# EAGLE design coqui-v1.0-linear (EAGLE 7.1.0)
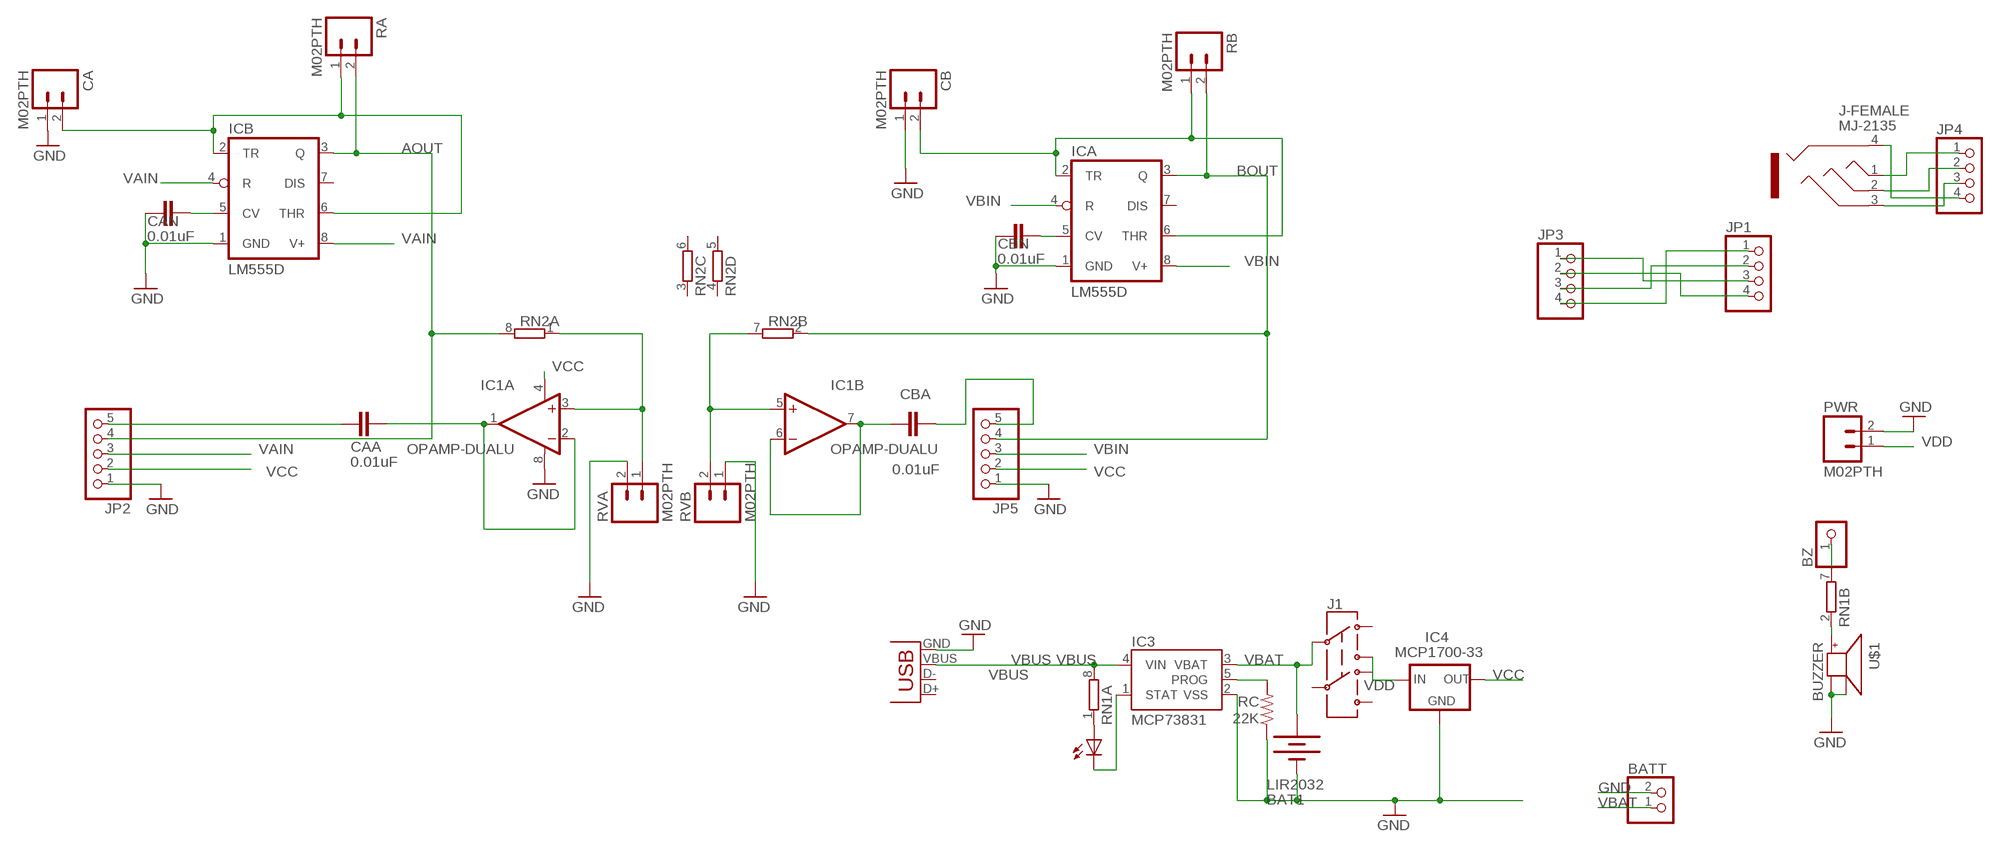
[diagram p0: schematic, sheet 1]

## Parts
BAT1  LIR2032  BATTERYBATTCOM_20MM_PTH_SMT  [BATTCOM_20MM_PTH_SMT]
BATT  JST_2PIN-SMT-RA  [JST-PH-2-SMT-RA]
BZ  PINHD-1X1  [1X01]
CA  M02PTH  [1X02]
CAA  0.01uF  C-EUC0805  [C0805@1]
CAN  0.01uF  C-EUC0805  [C0805@1]
CB  M02PTH  [1X02]
CBA  0.01uF  C-EUC0805  [C0805@1]
CBN  0.01uF  C-EUC0805  [C0805@1]
CHG  0805  LEDCHIPLED_0805  [CHIPLED_0805]
IC1  OPAMP-DUALU  [SO08]
IC3  MCP73831  [SOT23-5]
IC4  MCP1700-33  MCP1700SOT89  [SOT89]
ICA  LM555D  [SO08]
ICB  LM555D  [SO08]
J1  AYZ0202  [AYZ0202]
J-FEMALE  MJ-2135  [MJ-2135]
JP1  PINHD-1X4/90  [1X04/90]
JP2  PINHD-1X5  [1X05]
JP3  PINHD-1X4  [1X04]
JP4  PINHD-1X4  [1X04]
JP5  PINHD-1X5  [1X05]
PWR  M02PTH  [1X02]
RA  M02PTH  [1X02]
RB  M02PTH  [1X02]
RC  22K  R-US_R0805  [R0805]
RN1  4R-NEXB38V  [EXB38V]
RN2  4R-NEXB38V  [EXB38V]
RVA  M02PTH  [1X02]
RVB  M02PTH  [1X02]
U$1  BUZZER  [SMT-8585-BUZZER]
X1  USBSMD  [USB-MINIB]

## Nets
AOUT: ICB.3(Q) JP2.4 RA.2 RN2.8
BOUT: ICA.3(Q) JP5.4 RB.2 RN2.2
GND: BAT1.P$1(-) BATT.2 CA.1 CAN.1 CB.1 CBN.1 IC1.8(A:V+) IC3.2(VSS) IC4.1(GND) ICA.1(GND) ICB.1(GND) JP2.1 JP5.1 PWR.2 RC.1 RVA.2 RVB.1 U$1.- U$1.A- X1.GND
N$1: J-FEMALE.1 JP4.1
N$2: J-FEMALE.2 JP4.2
N$3: IC3.5(PROG) RC.2
N$4: J-FEMALE.3 JP4.3
N$5: CHG.C IC3.1(STAT)
N$6: J-FEMALE.4 JP4.4
N$7: BZ.1 RN1.7
N$8: CHG.A RN1.1
N$9: CAA.1 JP2.5
N$10: CAA.2 IC1.1(A:OUT) IC1.2(A:-IN)
N$11: CA.2 ICB.2(TR) ICB.6(THR) RA.1
N$12: RN1.2 U$1.+
N$13: CBA.2 JP5.5
N$14: CAN.2 ICB.5(CV)
N$15: CBN.2 ICA.5(CV)
N$16: CB.2 ICA.2(TR) ICA.6(THR) RB.1
N$18: JP1.1 JP3.4
N$19: JP1.3 JP3.1
N$20: JP1.2 JP3.3
N$21: JP1.4 JP3.2
N$23: IC1.3(A:+IN) IC1.5(B:+IN) RN2.1 RN2.7 RVA.1 RVB.2
N$24: CBA.1 IC1.6(B:-IN) IC1.7(B:OUT)
VAIN: ICB.4(R) ICB.8(V+) JP2.3
VBAT [power]: BAT1.P$2(+) BATT.1 IC3.3(VBAT) J1.2
VBIN: ICA.4(R) ICA.8(V+) JP5.3
VBUS [power]: IC3.4(VIN) RN1.8 X1.VBUS
VCC: IC1.4(A:V-) IC4.3(OUT) JP2.2 JP5.2
VDD: IC4.2(IN) J1.1 PWR.1
Unconnected: ICA.7(DIS) ICB.7(DIS) J1.3 J1.4 J1.5 J1.6 RN1.3 RN1.4 RN1.5 RN1.6 RN2.3 RN2.4 RN2.5 RN2.6 X1.D+ X1.D-

## Library data of the parts
BAT1 = SparkFunNew:BATTERY: Battery Holders Various common sizes : AA, AAA, 20mm coin cell and 12mm coin cell.
BATT = adafruit:JST_2PIN: JST 2-Pin Connectors of various flavors SMT-RA (S2B-PH-SM4) 4UConnector #17311 SMT (B2B-PH-SM4) THM-RA (S2B-PH) THM (B2B-PH)
BZ = pinhead:PINHD-1X1: PIN HEADER
CA CB PWR RA RB RVA RVB = SparkFun-Connectors:M02: Standard 2-pin 0.1" header. Use with - straight break away headers ( PRT-00116) - right angle break away headers (PRT-00553) - swiss pins (PRT-00743) - machine pins (PRT-00117) - female headers (PRT-00115) Molex polarized connector foot print use with: PRT-08233 with associated crimp pins and housings. 2.54_SCREWTERM for use with PRT-10571. 3.5mm Screw Terminal footprints for PRT-08084 5mm Screw Terminal footprints for use with PRT-08432
CAA CAN CBA CBN = rcl:C-EU: CAPACITOR, European symbol
CHG = led:LED: LED OSRAM: - CHIPLED LG R971, LG N971, LY N971, LG Q971, LY Q971, LO R971, LY R971 LH N974, LH R974 LS Q976, LO Q976, LY Q976 LO Q996 - Hyper CHIPLED LW Q18S LB Q993, LB Q99A, LB R99A - SideLED LS A670, LO A670, LY A670, LG A670, LP A670 LB A673, LV A673, LT A673, LW A673 LH A674 LY A675 LS A676, LA A676, LO A676, LY A676, LW A676 LS A679, LY A679, LG A679 - Hyper Micro SIDELED® LS Y876, LA Y876, LO Y876, LY Y876 LT Y87S - SmartLED LW L88C, LW L88S LB L89C, LB L89S, LG L890 LS L89K, LO L89K, LY L89K LS L896, LA L896, LO L896, LY L896 - TOPLED LS T670, LO T670, LY T670, LG T670, LP T670 LSG T670, LSP T670, LSY T670, LOP T670, LYG T670 LG T671, LOG T671, LSG T671 LB T673, LV T673, LT T673, LW T673 LH T674 LS T676, LA T676, LO T676, LY T676, LB T676, LH T676, LSB T676, LW T676 LB T67C, LV T67C, LT T67C, LS T67K, LO T67K, LY T67K, LW E67C LS E67B, LA E67B, LO E67B, LY E67B, LB E67C, LV E67C, LT E67C LW T67C LS T679, LY T679, LG T679 LS T770, LO T770, LY T770, LG T770, LP T770 LB T773, LV T773, LT T773, LW T773 LH T774 LS E675, LA E675, LY E675, LS T675 LS T776, LA T776, LO T776, LY T776, LB T776 LHGB T686 LT T68C, LB T68C - Hyper Mini TOPLED® LB M676 - Mini TOPLED Santana® LG M470 LS M47K, LO M47K, LY M47K Source: http://www.osram.convergy.de LUXEON: - LUMILED® LXK2-PW12-R00, LXK2-PW12-S00, LXK2-PW14-U00, LXK2-PW14-V00 LXK2-PM12-R00, LXK2-PM12-S00, LXK2-PM14-U00 LXK2-PE12-Q00, LXK2-PE12-R00, LXK2-PE12-S00, LXK2-PE14-T00, LXK2-PE14-U00 LXK2-PB12-K00, LXK2-PB12-L00, LXK2-PB12-M00, LXK2-PB14-N00, LXK2-PB14-P00, LXK2-PB14-Q00 LXK2-PR12-L00, LXK2-PR12-M00, LXK2-PR14-Q00, LXK2-PR14-R00 LXK2-PD12-Q00, LXK2-PD12-R00, LXK2-PD12-S00 LXK2-PH12-R00, LXK2-PH12-S00 LXK2-PL12-P00, LXK2-PL12-Q00, LXK2-PL12-R00 Source: www.luxeon.com KINGBRIGHT: KA-3528ASYC Source: www.kingbright.com
IC1 = SparkFun-AnalogIC:OPAMP-DUAL: Generic op-amp footprint
IC3 = SparkFunNew:MCP73831: Microchip's MCP73831 Miniature single cell, fully integrated Li-Ion, Li-polymer charge management controller http://ww1.microchip.com/downloads/en/DeviceDoc/21984a.pdf
IC4 = adafruit:MCP1700: VOLTAGE REGULATOR
ICA ICB = adafruit:*555: TIMER Changed DIP package to have round (not oval) pin pads http://www.ladyada.net/library/pcb/eaglelibrary.html
J1 = SparkFunNew:AYZ0202: SPDT Slide Switch Simple SMD single-pull double-throw slide switch. Good for less than 350mA power switch, switching UARTs between devices, etc. Spark Fun Electronics SKU : COM-00597
J-FEMALE = iPhoneSoftModem:MJ-2135
JP1 = trrs-dwb:PINHD-1X4: PIN HEADER
JP2 JP5 = pinhead:PINHD-1X5: PIN HEADER
JP3 JP4 = pinhead:PINHD-1X4: PIN HEADER
RC = adafruit2013:R-US_: RESISTOR, American symbol
RN1 RN2 = resistor-dil:4R-N: Array Chip Resistor Source: RS Component / Phycomp; OC_FARNELL: unknown; OC_NEWARK: unknown
U$1 = adafruit:BUZZER
X1 = SparkFun:USB: USB Connectors USB-B-PTH is fully proven SKU : PRT-00139 USB-miniB is fully proven SKU : PRT-00587 USB-A-PCB is untested. USB-A-H is throughly reviewed, but untested. Spark Fun Electronics SKU : PRT-00437 USB-B-SMT is throughly reviewed, but untested. Needs silkscreen touching up. USB-A-S has not been used/tested USB-MB-H has not been used/tested

## Net classes
0 default: width 0.254 mm, clearance 0.203 mm
1 power: width 0.254 mm, clearance 0.178 mm

## Board
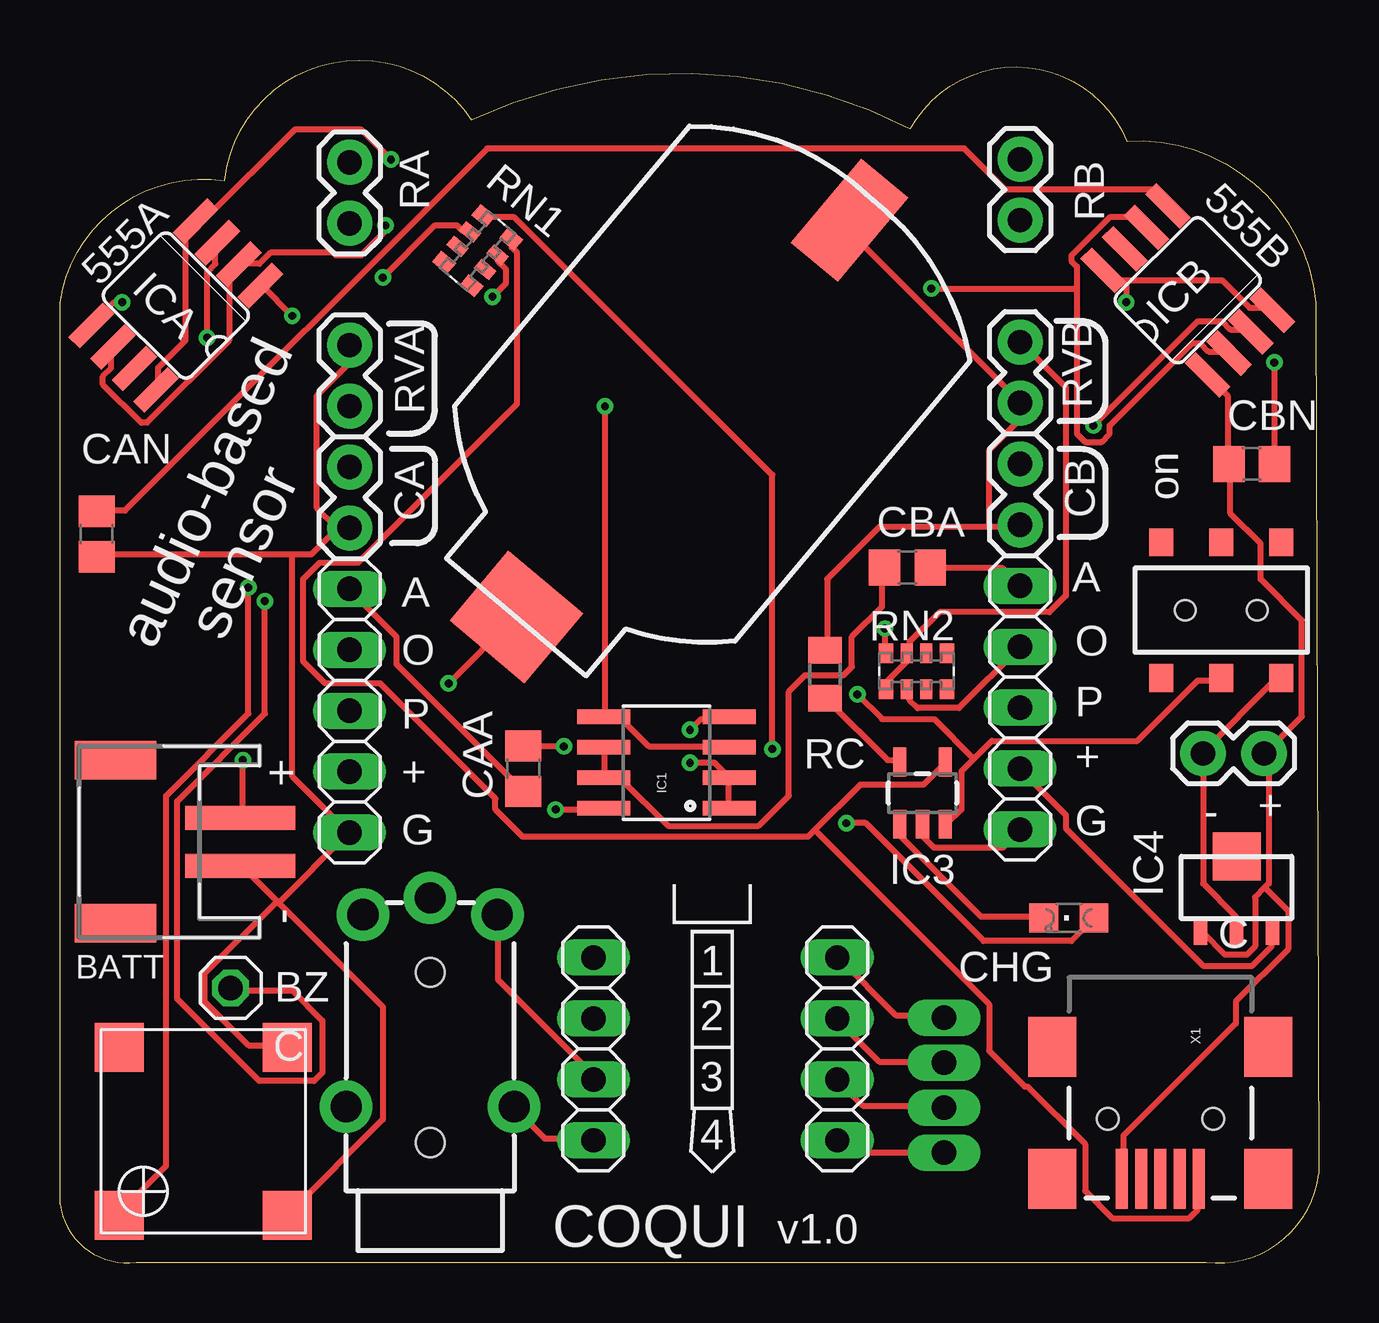
[diagram p1: board, top side]
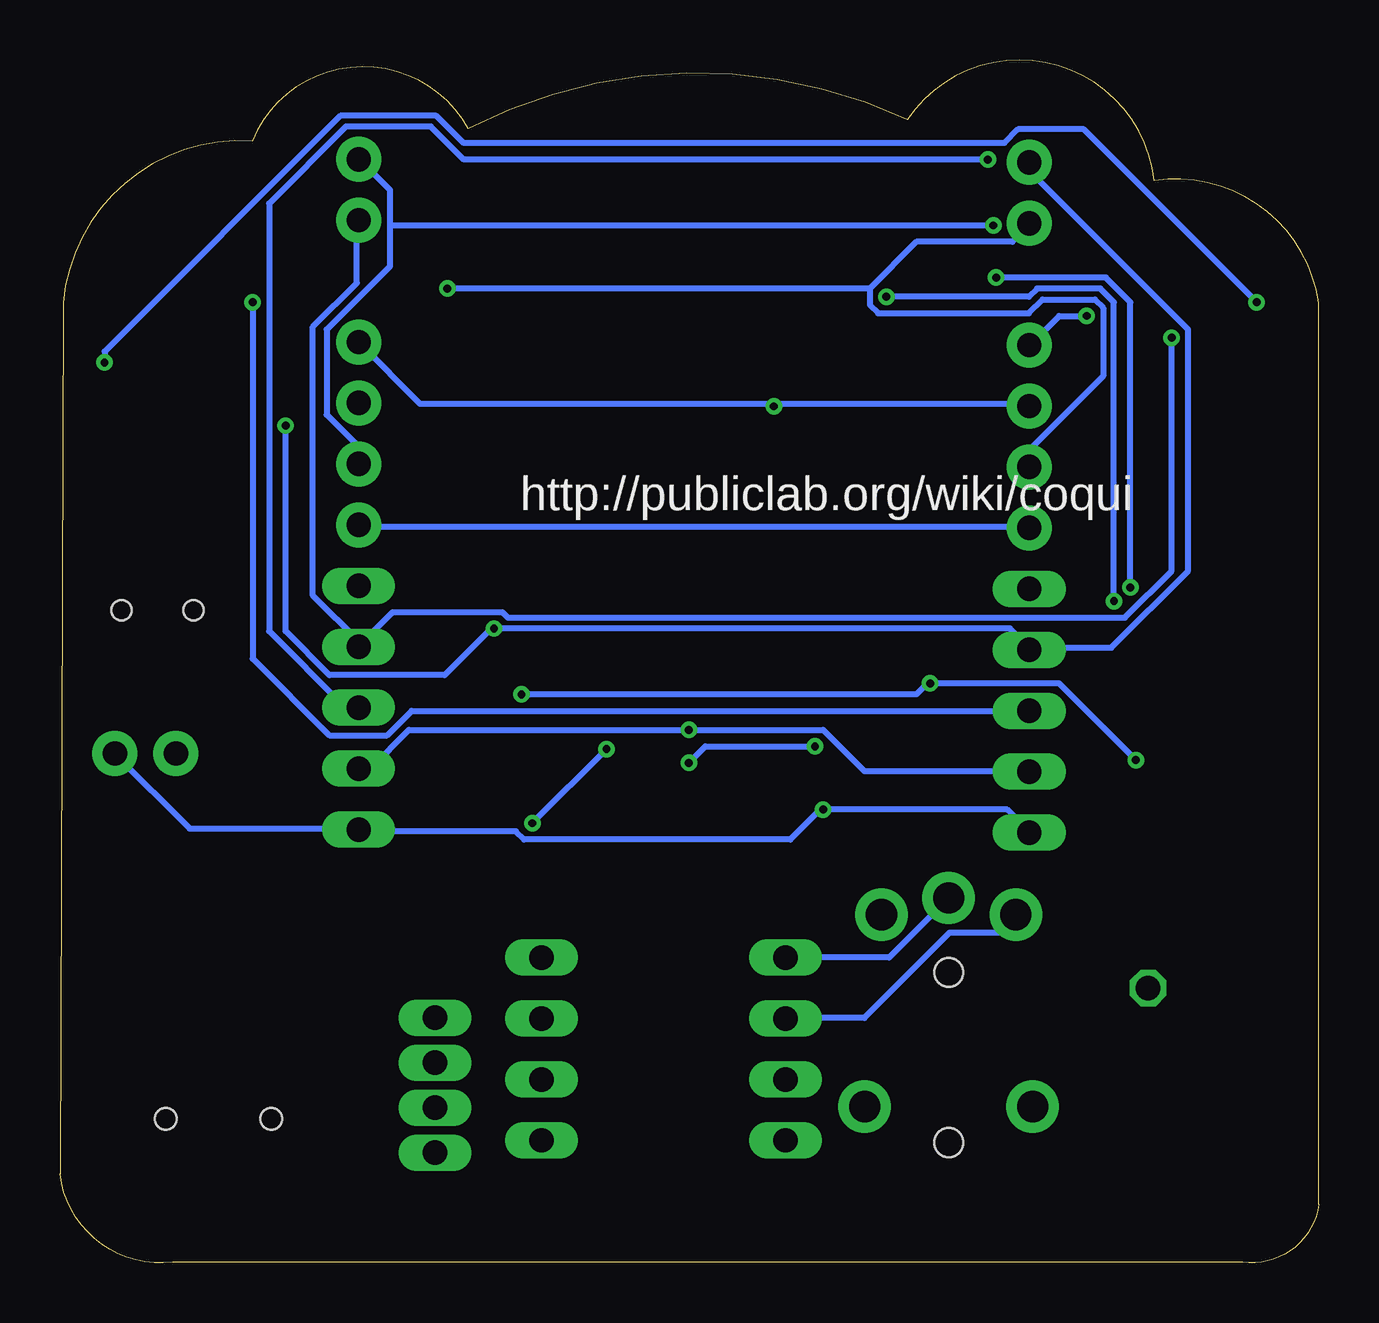
[diagram p2: board, bottom side, seen from below]

Size 52.45 x 50.14 mm. Coordinates in mm from the lower left corner, seen from the top.
Outline: 6.86,45.11 arc-140 17.14,47.65 arc-52 35.43,47.27 arc-128 44.45,46.76 arc-88 52.32,40.03 52.45,3.71 arc-90 47.75,0.03 3.17,0.03 arc-90 0,2.44 0,40.03 arc-90 6.86,45.11
Copper layers (1*16): Top 0.0356mm / dielectric 1.5011mm / Bottom 0.0356mm
Design rules "oshpark-2layer": minimum track width 6mil, minimum drill 13mil, track to track 6mil, track to pad 6mil, pad to pad 6mil, via to via 6mil, smd to smd 6mil, copper to edge 15mil, drill to drill 6mil, minimum pad ring 7mil, minimum via ring 7mil, stop-mask expansion 4mil, vias tented up to drill 0mil, thermal gap 10mil

### Footprints (pad centres in the part's own frame; a part is rotated, then mirrored left to right if it is on the bottom)
BATTCOM_20MM_PTH_SMT = smd 4.572 x 2.54: P$1 0,0 | smd 3.81 x 4.064: P$2 21.59,0
JST-PH-2-SMT-RA = smd 1 x 4.6: 1 1,-3.7; 2 -1,-3.7 | smd 1.6 x 3.4: NC1 -3.4,1.5; NC2 3.4,1.5
1X01 = drill 1.016 octagon: 1 0,0
1X02 = drill 1.016 pad 1.88: 1 0,0; 2 2.54,0
C0805@1 = smd 1.3 x 1.5: 1 -0.95,0; 2 0.95,0
CHIPLED_0805 = smd 1.2 x 1.2: A 0,-1.05; C 0,1.05
SO08 = smd 0.61 x 2.21: 1 -1.905,-2.616; 2 -0.635,-2.616; 3 0.635,-2.616; 4 1.905,-2.616; 5 1.905,2.616; 6 0.635,2.616; 7 -0.635,2.616; 8 -1.905,2.616
SOT23-5 = smd 0.55 x 1.2: 1 -0.95,-1.3; 2 0,-1.3; 3 0.95,-1.3; 4 0.95,1.3; 5 -0.95,1.3
SOT89 = smd 0.58 x 1.2: 1 -1.5,-1.8; 2 0,-1.8; 3 1.5,-1.8 | smd 2 x 2: 4 0,1.3
SO08' = smd 0.66 x 2.032: 1 -1.905,-3.073; 2 -0.635,-3.073; 3 0.635,-3.073; 4 1.905,-3.073; 5 1.905,3.073; 6 0.635,3.073; 7 -0.635,3.073; 8 -1.905,3.073
AYZ0202 = smd 1 x 1.15: 1 -2.5,2.825; 2 0,2.825; 3 2.5,2.825; 4 -2.5,-2.825; 5 0,-2.825; 6 2.5,-2.825 | hole 0.85: 1.5,0; -1.5,0
MJ-2135 = drill 1.3 pad 2.184: 1 0,8.5; 1@2 7,8.5; 2 0.7,0.5; 3 6.3,0.5; 4 3.5,-0.2 | hole 1.2: 3.5,2.9; 3.5,10
1X04/90 = drill 1.016 long: 1 2.928,-2.286; 2 1.053,-2.286; 3 -2.697,-2.286; 4 -0.822,-2.286
1X05 = drill 1.016 long: 1 -5.08,0; 2 -2.54,0; 3 0,0; 4 2.54,0; 5 5.08,0
1X04 = drill 1.016 long: 1 -3.81,0; 2 -1.27,0; 3 1.27,0; 4 3.81,0
R0805 = smd 1.1 x 1.4: 1 -1,0; 2 1,0
EXB38V = smd 0.6 x 0.8: 1 -1.275,-0.75; 4 1.275,-0.75; 5 1.275,0.75; 8 -1.275,0.75 | smd 0.5 x 0.8: 2 -0.4,-0.75; 3 0.4,-0.75; 6 0.4,0.75; 7 -0.4,0.75
SMT-8585-BUZZER = smd 2.05 x 2.05: + -3.5,-3.5; - 3.5,-3.5; A- 3.5,3.5; NC1 -3.5,3.5
USB-MINIB = smd 2.5 x 0.5: D+ 2.5,0; D- 2.5,0.8; GND 2.5,-1.6; ID 2.5,-0.8; VBUS 2.5,1.6 | smd 2.5 x 2: GND@1 -3,-4.5; GND@2 -3,4.5; GND@3 2.5,4.5; GND@4 2.5,-4.5 | hole 0.9: 0,2.2; 0,-2.2

### Placement (x,y rotation side)
BAT1  32.89,43.46 230 top
BATT  3.81,17.55 90 top
BZ  7.11,11.46 180 top
CA  12.07,30.64 90 top
CAA  19.3,20.6 90 top
CAN  1.52,30.38 90 top
CB  40.01,30.76 90 top
CBA  35.31,28.98 0 top
CBN  49.66,33.3 0 top
CHG  42.04,14.38 90 top
IC1  25.27,20.86 90 top
IC3  35.94,19.59 0 top
IC4  49.02,15.65 0 top
ICA  LM555D  [SO08']  4.83,39.91 135 top
ICB  LM555D  [SO08']  46.99,40.54 45 top
J1  48.39,27.21 180 top
J-FEMALE  18.92,15.01 180 top
JP1  39.12,7.52 270 top
JP2  12.07,23.02 90 top
JP3  32.38,8.92 270 top
JP4  22.23,8.92 90 top
JP5  40.01,23.14 90 top
PWR  47.62,21.24 0 top
RA  12.07,43.34 90 top
RB  40.01,46 270 top
RC  31.88,24.54 270 top
RN1  17.4,42.19 230 top
RN2  35.69,24.67 0 top
RVA  12.07,35.72 90 top
RVB  40.01,35.84 90 top
U$1  5.97,5.49 0 top
X1  45.85,6 270 top

### Tracks (layer width: path | path; a pad name or v marks a point on that pad's centre or on a via)
AOUT  (via drill 0.33)
  Top 0.254: v34.37,26.44 34.37,25.53 RN2.8 | v43.05,34.9 47.4,39.25 48.42,39.25 48.77,38.9 49.57,38.9 ICB.3
  Bottom 0.254: v43.05,34.9 43.05,26.33 41.22,24.5 36.42,24.5 34.48,26.44 v34.37,26.44 12.88,26.44 12.08,25.64 JP2.4 11.96,25.64 8.65,25.64 5.45,28.84 5.45,38.9 11.96,45.42 11.96,45.88 RA.2
BOUT  (via drill 0.33)
  Top 0.254: JP5.4 37.45,23.13 35.74,23.13 35.4,23.47 35.4,23.82 RN2.2 | v6.13,38.56 6.13,41.3 6.48,41.65 6.48,42.45 ICA.3
  Bottom 0.254: v6.13,38.56 6.13,28.84 8.08,26.9 33.8,26.9 34.02,27.13 38.59,27.13 39.97,25.76 JP5.4 39.97,25.87 41.91,27.82 41.91,39.02 40.08,40.85 40.08,43.36 RB.2
GND  (via drill 0.33)
  Top 0.254: IC3.2 35.97,18.21 35.97,17.76 36.42,17.3 39.28,17.3 39.97,17.99 JP5.1 | ICB.1 47.85,36.96 48.65,36.16 48.65,33.3 CBN.1 48.77,33.19 48.77,31.25 50.02,29.99 50.02,28.5 51.74,26.79 51.74,22.79 50.25,21.3 PWR.2 50.25,21.19 50.37,21.07 50.37,15.81 50.2,15.64 | 50.2,15.64 49.8,15.24 49.8,13.19 49.45,12.84 48.54,12.84 47.62,13.76 IC4.1 | 50.2,15.64 51.17,14.67 51.17,13.07 49,10.9 49,9.99 44.31,5.3 44.31,3.58 X1.GND | 38.71,30.67 39.97,30.67 CB.1 | 38.71,30.67 34.14,30.67 31.97,28.5 31.97,25.64 RC.1 | 38.71,30.67 38.71,33.87 39.97,35.13 39.97,35.82 RVB.1 39.97,35.93 32.99,42.9 32.99,43.36 BAT1.P$1 | v9.68,39.47 8.42,40.73 ICA.1 | 9.68,29.53 10.48,29.53 11.51,30.56 11.96,30.56 CA.1 11.51,30.67 10.71,31.47 10.71,36.16 11.96,37.42 11.96,38.22 RVA.2 | 9.68,29.53 1.56,29.53 CAN.1 | v20.65,18.9 22.59,18.9 IC1.8 | 9.05,15.07 7.62,16.5 BATT.2 | 9.05,15.07 9.11,15.01 | 9.11,15.01 13.45,10.67 13.45,5.98 9.56,2.1 U$1.- | 9.05,15.07 6.02,12.04 6.02,10.9 7.85,9.07 9.45,9.07 U$1.A- | 9.11,15.01 11.96,17.87 JP2.1 11.96,17.99 9.68,20.27 9.68,29.53
  Bottom 0.254: PWR.2 50.14,21.19 47.05,18.1 40.08,18.1 JP5.1 39.97,17.99 33.45,17.99 33.11,17.64 22.02,17.64 20.77,18.9 v20.65,18.9 12.99,18.9 12.08,17.99 JP2.1 | v9.68,39.47 10.82,39.47 11.96,38.33 RVA.2 | CB.1 39.97,30.67 12.08,30.67 CA.1
N$1
  Top 0.254: JP4.1 22.14,5.18 20.19,5.18 18.94,6.44 J-FEMALE.1
N$2
  Top 0.254: JP4.2 22.14,7.7 22.14,7.93 18.25,11.81 18.25,14.44 J-FEMALE.2
N$3
  Top 0.254: IC3.5 34.94,20.96 34.48,20.96 31.97,23.47 RC.2
N$4
  Bottom 0.254: JP4.3 22.14,10.21 18.94,10.21 15.39,13.76 13.34,13.76 12.65,14.44 J-FEMALE.3
N$5
  Top 0.254: CHG.C 40.88,14.44 38.37,14.44 35.05,17.76 35.05,18.21 IC3.1
N$6
  Bottom 0.254: JP4.4 17.91,12.73 15.51,15.13 J-FEMALE.4
N$7  (via drill 0.33)
  Top 0.254: v18.02,40.27 18.59,40.85 18.59,41.42 18.25,41.76 18.25,41.99 RN1.7 | v8.53,27.59 8.53,22.9 4.88,19.24 4.88,11.01 8.31,7.58 10.59,7.58 10.94,7.93 10.94,10.1 9.68,11.36 7.16,11.36 BZ.1
  Bottom 0.254: v18.02,40.27 12.08,40.27 11.74,40.62 9.11,40.62 8.53,40.05 v8.53,27.59
N$8  (via drill 0.33)
  Top 0.254: v29.68,21.42 29.68,32.85 18.94,43.59 17.68,43.59 RN1.1 | v32.77,18.33 33.57,18.33 38.48,13.41 42.14,13.41 43.05,14.33 CHG.A
  Bottom 0.254: v32.77,18.33 v29.68,21.42
N$9
  Top 0.254: CAA.1 19.28,19.7 14.02,24.96 14.02,26.1 12.08,28.04 JP2.5
N$10  (via drill 0.33)
  Top 0.254: v20.99,21.53 19.39,21.53 CAA.2 | v26.25,20.84 27.28,20.84 27.85,20.27 IC1.2 27.85,20.16 27.85,19.02 IC1.1
  Bottom 0.254: v20.99,21.53 25.57,21.53 v26.25,20.84
N$11  (via drill 0.33)
  Top 0.254: 42.37,40.62 42.37,41.53 42.14,41.76 42.14,41.99 43.74,43.59 44.88,43.59 45.23,43.25 ICB.6 | 42.37,40.62 42.37,34.56 42.71,34.22 43.4,34.22 43.74,34.56 43.74,34.9 47.17,38.33 47.51,38.33 47.85,37.99 48.65,37.99 ICB.2 | v36.31,40.62 42.37,40.62
  Bottom 0.254: 18.71,40.62 18.71,39.93 18.36,39.59 12.08,39.59 11.51,40.16 9.33,40.16 8.99,39.82 8.99,36.96 11.96,33.99 11.96,33.19 CA.2 | 18.71,40.62 16.76,42.56 12.76,42.56 12.08,43.25 RA.1 | 18.71,40.62 v36.31,40.62
N$12  (via drill 0.33)
  Top 0.254: v13.45,41.07 15.62,43.25 16.54,43.25 16.76,43.02 16.99,43.02 RN1.2 | v7.85,28.16 7.85,22.9 4.42,19.47 4.42,4.04 2.48,2.1 U$1.+
  Bottom 0.254: v13.45,41.07 8.88,41.07 7.85,40.05 v7.85,28.16
N$13
  Top 0.254: CBA.2 36.31,28.96 39.28,28.96 39.97,28.27 JP5.5
N$14
  Top 0.254: CAN.2 1.56,31.36 2.71,31.36 17.79,46.45 37.68,46.45 39.4,44.73 45.57,44.73 46.14,44.16 ICB.5
N$15  (via drill 0.33)
  Top 0.254: v50.6,37.53 50.6,33.3 CBN.2 | v2.59,40.05 2.25,40.05 1.33,39.13 ICA.5
  Bottom 0.254: v50.6,37.53 50.6,37.99 40.77,47.82 36.77,47.82 35.62,46.68 13.11,46.68 12.54,47.25 9.79,47.25 v2.59,40.05
N$16  (via drill 0.33)
  Top 0.254: ICA.6 2.13,38.1 2.13,37.3 1.79,36.96 1.79,36.62 3.39,35.02 3.62,35.02 7.05,38.45 7.05,41.19 7.39,41.53 ICA.2 7.51,41.65 8.31,41.65 8.76,42.1 11.39,42.1 11.51,41.99 12.54,41.99 13.56,43.02 v13.56,43.25
  Bottom 0.254: 38.71,43.25 38.71,44.73 39.97,45.99 RB.1 | 38.71,43.25 38.71,41.53 41.34,38.9 41.34,35.36 40.08,34.1 40.08,33.3 CB.2 | 38.71,43.25 v13.56,43.25
N$18
  Top 0.254: JP3.4 32.88,4.61 36.77,4.61 JP1.1
N$19
  Top 0.254: JP1.3 36.77,10.33 34.82,10.33 32.42,12.73 JP3.1
N$20
  Top 0.254: JP1.2 36.77,6.56 33.45,6.56 32.42,7.58 JP3.3
N$21
  Top 0.254: JP1.4 36.77,8.39 34.14,8.39 32.42,10.1 JP3.2
N$23  (via drill 0.33)
  Top 0.254: IC1.3 27.85,21.53 24.54,21.53 23.39,22.67 22.71,22.67 IC1.5 22.71,22.79 v22.71,35.7 | RN2.1 34.48,23.93 34.48,24.27 35.28,25.07 RN2.7 35.4,25.53 35.4,25.87 36.65,27.13 41.22,27.13 41.91,27.82 41.91,36.5 40.08,38.33 RVB.2
  Bottom 0.254: 22.71,35.82 37.45,35.82 39.97,38.33 RVB.2 | 22.71,35.82 12.08,35.82 RVA.1 | v22.71,35.7 22.71,35.82
N$24
  Top 0.254: CBA.1 34.25,28.96 34.25,27.36 32.99,26.1 32.99,24.84 32.65,24.5 31.05,24.5 30.37,23.82 30.37,19.47 29.11,18.21 25.34,18.21 23.39,20.16 22.71,20.16 IC1.7 22.71,20.27 22.71,21.42 IC1.6
VAIN  (via drill 0.33)
  Top 0.254: 44.42,40.96 43.85,40.96 43.51,41.3 ICB.8 | 44.42,40.96 48.42,40.96 49.57,39.82 50.48,39.82 ICB.4 | 44.42,40.96 v44.42,40.05
  Bottom 0.254: JP2.3 37.8,23.02 38.82,21.99 41.22,21.99 44.42,25.19 v44.42,40.05
VBAT  (via drill 0.33)
  Top 0.254: 38.08,21.02 37.57,20.5 37.57,18.9 36.99,18.33 IC3.3 | 38.08,21.02 38.82,21.76 44.88,21.76 47.4,24.27 48.31,24.27 J1.2 | v16.19,24.16 18.94,26.9 BAT1.P$2 | v7.62,20.96 7.62,18.56 BATT.1 | 38.08,21.02 36.42,22.67 34.25,22.67 v33.22,23.7
  Bottom 0.254: v7.62,20.96 10.82,24.16 v16.19,24.16 16.31,24.16 16.76,23.7 v33.22,23.7
VBIN  (via drill 0.33)
  Top 0.254: ICA.8 4.08,36.39 4.08,37.3 5.22,38.45 5.22,43.02 5.56,43.36 ICA.4 5.68,43.48 6.02,43.48 9.79,47.25 12.54,47.25 v13.79,45.99
  Bottom 0.254: v13.79,45.99 35.62,45.99 36.99,47.36 40.54,47.36 43.74,44.16 43.74,26.33 40.65,23.24 40.08,23.24 JP5.3
VBUS
  Top 0.254: 31.45,18.04 33.34,19.93 35.97,19.93 36.88,20.84 IC3.4 | 31.45,18.04 31.17,17.76 19.28,17.76 18.14,18.9 18.14,19.36 13.34,24.16 11.05,24.16 10.13,25.07 10.13,28.5 10.82,29.19 12.42,29.19 19.05,35.82 19.05,42.1 18.82,42.33 18.82,42.68 RN1.8 | 31.45,18.04 38.71,10.79 38.71,8.84 40.2,7.36 40.31,7.36 42.71,4.96 42.71,3.01 43.85,1.87 47.05,1.87 47.4,2.21 47.4,3.47 X1.VBUS
VCC  (via drill 0.33)
  Top 0.254: IC4.3 50.48,13.76 50.48,13.19 49.68,12.39 47.62,12.39 41.91,18.1 41.91,18.67 40.08,20.5 JP5.2 | v26.25,22.22 26.71,22.67 27.85,22.67 IC1.4
  Bottom 0.254: JP5.2 39.97,20.62 39.51,20.62 37.91,22.22 v26.25,22.22 20.65,22.22 18.94,20.5 12.08,20.5 JP2.2
VDD
  Top 0.254: J1.1 50.83,24.27 50.6,24.27 47.62,21.3 PWR.1 47.62,15.81 49,14.44 49,13.87 IC4.2

### Text on the board
tPlace: 555B | 555A | audio-based | on | sensor | A | A | O | O | P | P | + | + | - | G | + | G | IC3 | IC4 | C | 1 | 2 | C | 3 | 4 | COQUI | v1.0
bPlace: http://publiclab.org/wiki/coqui